# Altium schematic sheet JTAG_connector1.SchDoc
size A
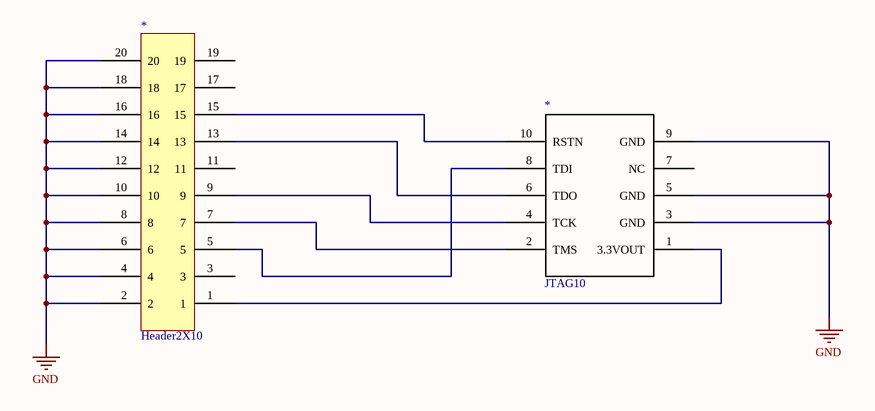
[diagram p0: JTAG_connector1.SchDoc]

## Parts
(Parts that share a designator on the sheet are numbered #1, #2 ... from top to bottom, then left to right.)
*#1  JTAG10  [JTAG-10]
*#2  Header2X10  [JTAG-20]

## Nets
GND: *#1.3(GND) *#1.5(GND) *#1.9(GND) *#2.2 *#2.4 *#2.6 *#2.8 *#2.10 *#2.12 *#2.14 *#2.16 *#2.18 *#2.20
Net*#1_1: *#1.1(3.3VOUT) *#2.1
Net*#1_2: *#1.2(TMS) *#2.7
Net*#1_4: *#1.4(TCK) *#2.9
Net*#1_6: *#1.6(TDO) *#2.13
Net*#1_8: *#1.8(TDI) *#2.5
Net*#1_10: *#1.10(RSTN) *#2.15

Not connected (* = marked no-connect by the designer): *#1 7(NC); *#2 3 11 17 19

## Library data of the parts
*#2 = Header2X10: Header JTAG 20 pin